# Altium schematic sheet [5] AnalogChannels_1_2_3_4.SchDoc: =DocumentName
size A3; Organization: ORGANIZATION; Address1: R. Aprígio Veloso, 882, Universitário; Address2: Campina Grande - PB; Address3: 58429-900; DocumentNumber: 5; Revision: -; SheetNumber: 5; SheetTotal: 8; ENG_DATE: --/--/--; DSN_DATE: --/--/--; CHK_DATE: --/--/--; SCH_SCALE: 1:1
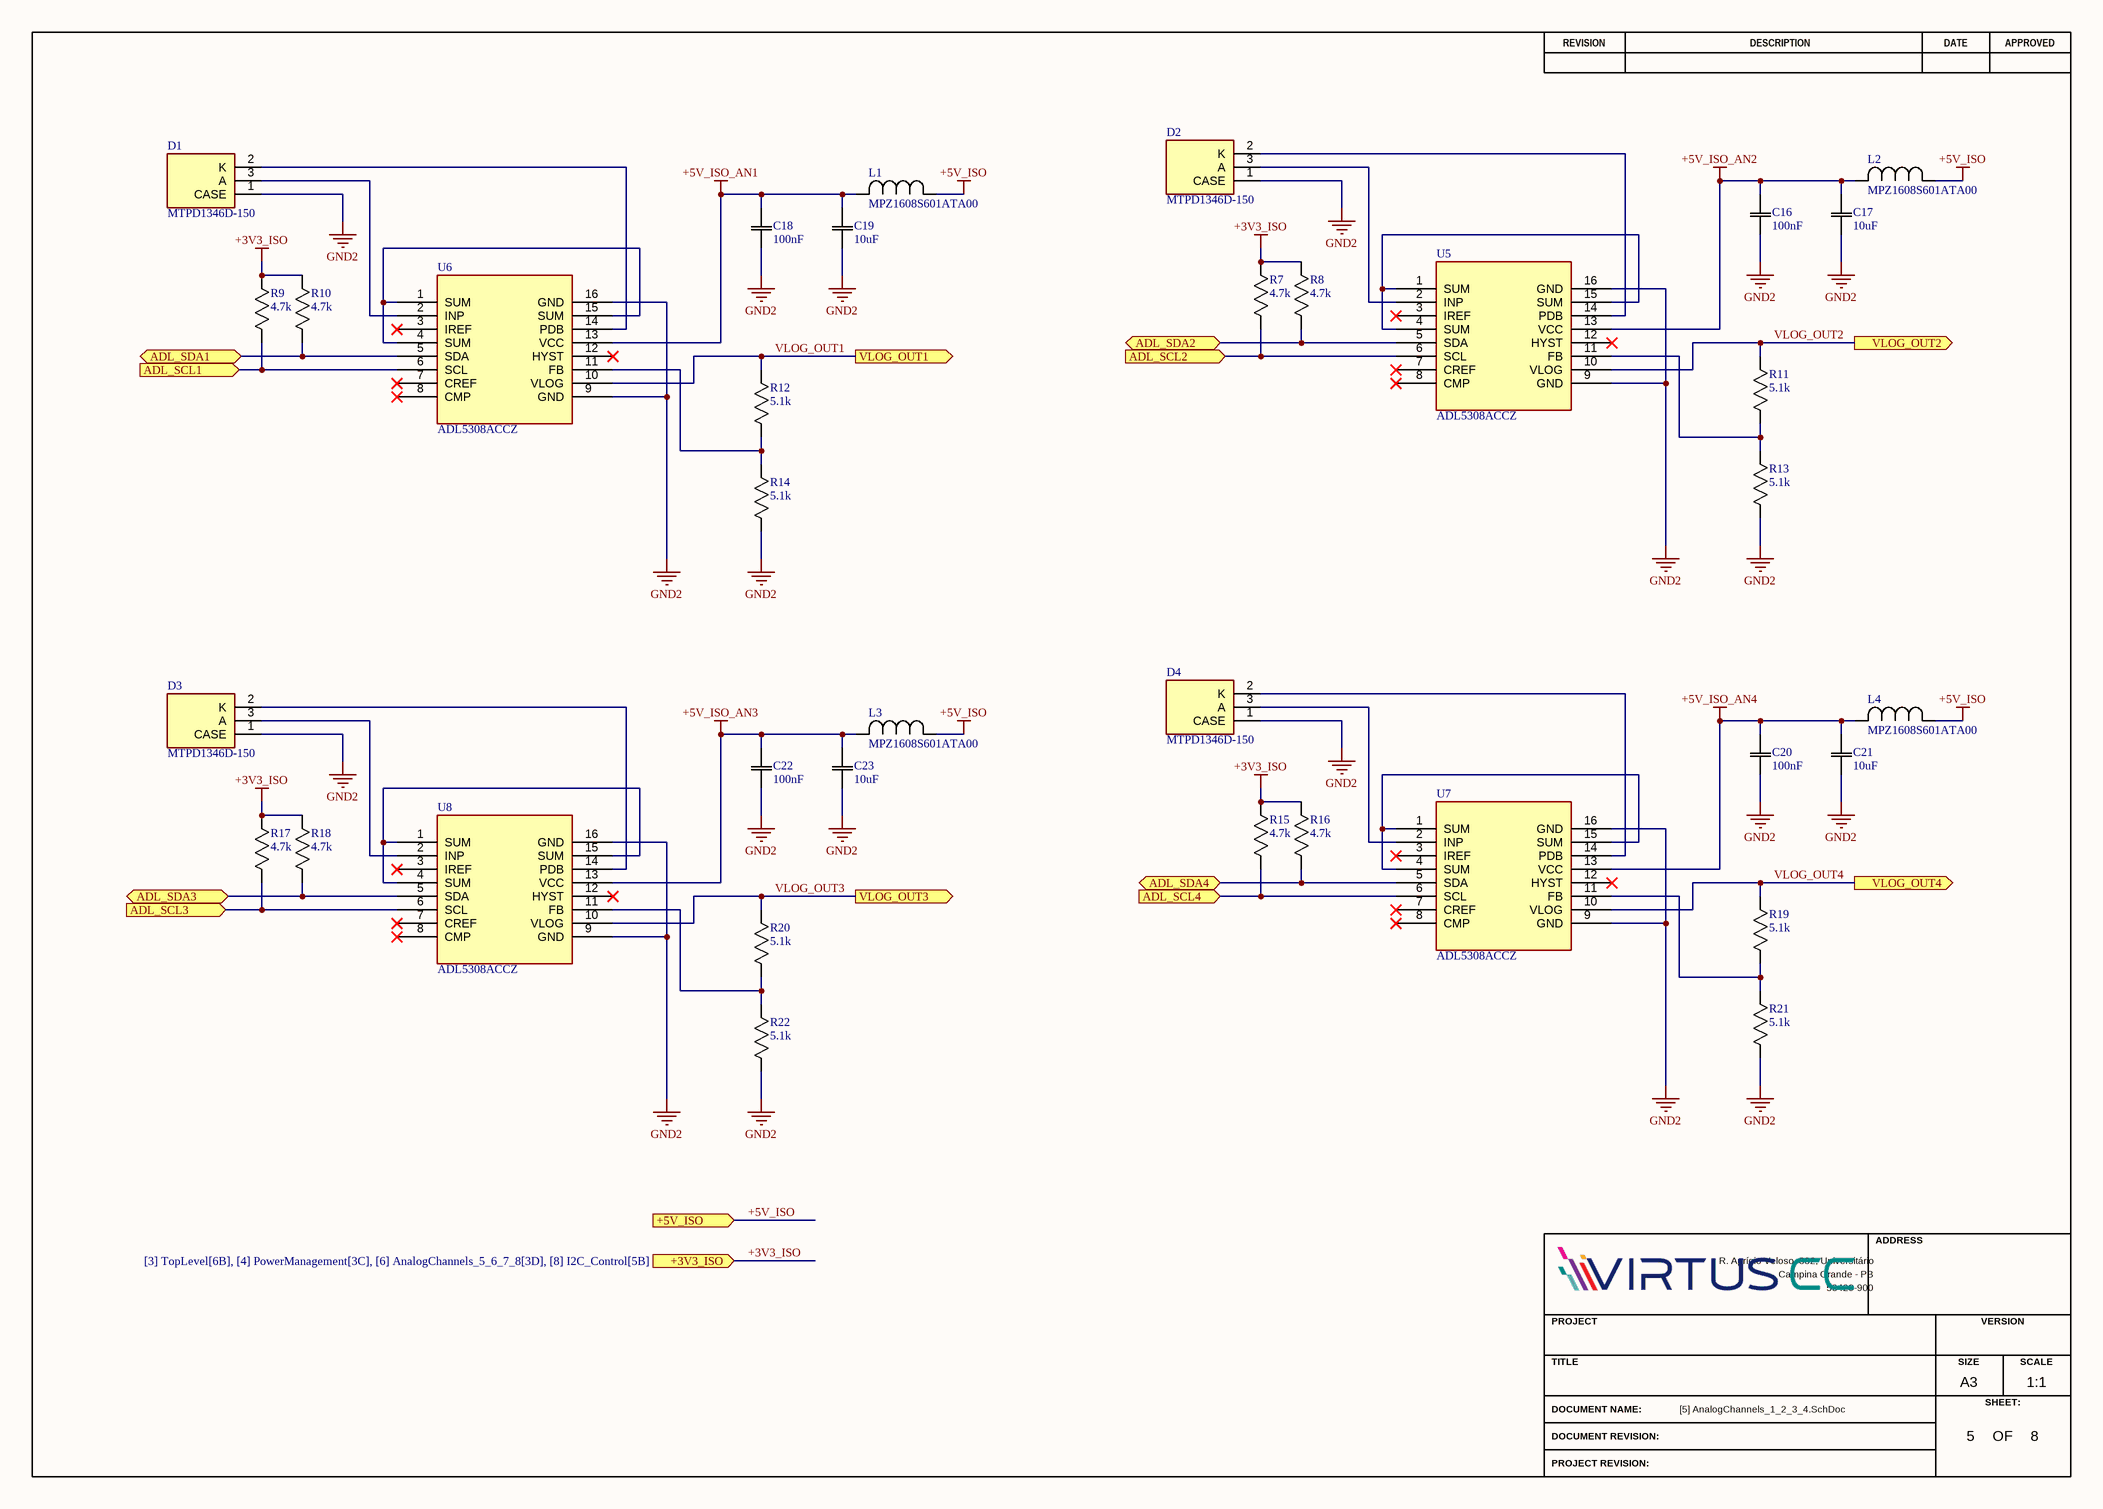
[diagram p0: [5] AnalogChannels_1_2_3_4.SchDoc]

## Parts
C16  value 100nF  [CAPC1005X40N]  (hidden comment: GCM155R71H104KE02D)
C17  value 10uF  [CAPC1005X40N]  (hidden comment: GRT155R61A106ME13D)
C18  value 100nF  [CAPC1005X40N]  (hidden comment: GCM155R71H104KE02D)
C19  value 10uF  [CAPC1005X40N]  (hidden comment: GRT155R61A106ME13D)
C20  value 100nF  [CAPC1005X40N]  (hidden comment: GCM155R71H104KE02D)
C21  value 10uF  [CAPC1005X40N]  (hidden comment: GRT155R61A106ME13D)
C22  value 100nF  [CAPC1005X40N]  (hidden comment: GCM155R71H104KE02D)
C23  value 10uF  [CAPC1005X40N]  (hidden comment: GRT155R61A106ME13D)
D1  MTPD1346D-150  [TO127P540X1680-3N]
D2  MTPD1346D-150  [TO127P540X1680-3N]
D3  MTPD1346D-150  [TO127P540X1680-3N]
D4  MTPD1346D-150  [TO127P540X1680-3N]
L1  MPZ1608S601ATA00  [INDC1608X06N]
L2  MPZ1608S601ATA00  [INDC1608X06N]
L3  MPZ1608S601ATA00  [INDC1608X06N]
L4  MPZ1608S601ATA00  [INDC1608X06N]
R7  value 4.7k  [RESC1005X40N]  (hidden comment: RC0402FR-074K7L)
R8  value 4.7k  [RESC1005X40N]  (hidden comment: RC0402FR-074K7L)
R9  value 4.7k  [RESC1005X40N]  (hidden comment: RC0402FR-074K7L)
R10  value 4.7k  [RESC1005X40N]  (hidden comment: RC0402FR-074K7L)
R11  value 5.1k  [RESC1005X40N]  (hidden comment: RC0402FR-075K1L)
R12  value 5.1k  [RESC1005X40N]  (hidden comment: RC0402FR-075K1L)
R13  value 5.1k  [RESC1005X40N]  (hidden comment: RC0402FR-075K1L)
R14  value 5.1k  [RESC1005X40N]  (hidden comment: RC0402FR-075K1L)
R15  value 4.7k  [RESC1005X40N]  (hidden comment: RC0402FR-074K7L)
R16  value 4.7k  [RESC1005X40N]  (hidden comment: RC0402FR-074K7L)
R17  value 4.7k  [RESC1005X40N]  (hidden comment: RC0402FR-074K7L)
R18  value 4.7k  [RESC1005X40N]  (hidden comment: RC0402FR-074K7L)
R19  value 5.1k  [RESC1005X40N]  (hidden comment: RC0402FR-075K1L)
R20  value 5.1k  [RESC1005X40N]  (hidden comment: RC0402FR-075K1L)
R21  value 5.1k  [RESC1005X40N]  (hidden comment: RC0402FR-075K1L)
R22  value 5.1k  [RESC1005X40N]  (hidden comment: RC0402FR-075K1L)
U5  ADL5308ACCZ  [CC-14-4_ADI]
U6  ADL5308ACCZ  [CC-14-4_ADI]
U7  ADL5308ACCZ  [CC-14-4_ADI]
U8  ADL5308ACCZ  [CC-14-4_ADI]

## Ports
+3V3_ISO (in, see [3] TopLevel[6B], [4] PowerManagement[3C], [6] AnalogChannels_5_6_7_8[3D], [8] I2C_Control[5B]), +5V_ISO (in, see [3] TopLevel[6B], [4] PowerManagement[4B], [6] AnalogChannels_5_6_7_8[3D]), ADL_SCL1 (in, see [3] TopLevel[6B], [8] I2C_Control[3A]), ADL_SCL2 (in, see [3] TopLevel[6B], [8] I2C_Control[3B]), ADL_SCL3 (in, see [3] TopLevel[6B], [8] I2C_Control[3B]), ADL_SCL4 (in, see [3] TopLevel[6B], [8] I2C_Control[3B]), ADL_SDA1 (bidir, see [3] TopLevel[6B], [8] I2C_Control[3A]), ADL_SDA2 (bidir, see [3] TopLevel[6B], [8] I2C_Control[3B]), ADL_SDA3 (bidir, see [3] TopLevel[6B], [8] I2C_Control[3B]), ADL_SDA4 (bidir, see [3] TopLevel[6B], [8] I2C_Control[3B]), VLOG_OUT1 (out, see [3] TopLevel[7B], [7] ADC_Acquisition[3A]), VLOG_OUT2 (out, see [3] TopLevel[7B], [7] ADC_Acquisition[3A]), VLOG_OUT3 (out, see [3] TopLevel[7B], [7] ADC_Acquisition[3A]), VLOG_OUT4 (out, see [3] TopLevel[7B], [7] ADC_Acquisition[3A])

## Nets
+3V3_ISO: R7.1 R8.1 R9.1 R10.1 R15.1 R16.1 R17.1 R18.1 ; port +3V3_ISO
+5V_ISO: L1.1 L2.1 L3.1 L4.1 ; port +5V_ISO
+5V_ISO_AN1: C18.2 C19.2 L1.2 U6.13(VCC)
+5V_ISO_AN2: C16.2 C17.2 L2.2 U5.13(VCC)
+5V_ISO_AN3: C22.2 C23.2 L3.2 U8.13(VCC)
+5V_ISO_AN4: C20.2 C21.2 L4.2 U7.13(VCC)
GND2: C16.1 C17.1 C18.1 C19.1 C20.1 C21.1 C22.1 C23.1 D1.1(CASE) D2.1(CASE) D3.1(CASE) D4.1(CASE) R13.2 R14.2 R21.2 R22.2 U5.9(GND) U5.16(GND) U6.9(GND) U6.16(GND) U7.9(GND) U7.16(GND) U8.9(GND) U8.16(GND)
ADL_SCL1: R9.2 U6.6(SCL) ; port ADL_SCL1
ADL_SCL2: R7.2 U5.6(SCL) ; port ADL_SCL2
ADL_SCL3: R17.2 U8.6(SCL) ; port ADL_SCL3
ADL_SCL4: R15.2 U7.6(SCL) ; port ADL_SCL4
ADL_SDA1: R10.2 U6.5(SDA) ; port ADL_SDA1
ADL_SDA2: R8.2 U5.5(SDA) ; port ADL_SDA2
ADL_SDA3: R18.2 U8.5(SDA) ; port ADL_SDA3
ADL_SDA4: R16.2 U7.5(SDA) ; port ADL_SDA4
VLOG_OUT1: R12.1 U6.10(VLOG) ; port VLOG_OUT1
VLOG_OUT2: R11.1 U5.10(VLOG) ; port VLOG_OUT2
VLOG_OUT3: R20.1 U8.10(VLOG) ; port VLOG_OUT3
VLOG_OUT4: R19.1 U7.10(VLOG) ; port VLOG_OUT4
NetD1_2: D1.2(K) U6.14(PDB)
NetD1_3: D1.3(A) U6.2(INP)
NetD2_2: D2.2(K) U5.14(PDB)
NetD2_3: D2.3(A) U5.2(INP)
NetD3_2: D3.2(K) U8.14(PDB)
NetD3_3: D3.3(A) U8.2(INP)
NetD4_2: D4.2(K) U7.14(PDB)
NetD4_3: D4.3(A) U7.2(INP)
NetR11_2: R11.2 R13.1 U5.11(FB)
NetR12_2: R12.2 R14.1 U6.11(FB)
NetR19_2: R19.2 R21.1 U7.11(FB)
NetR20_2: R20.2 R22.1 U8.11(FB)
NetU5_1: U5.1(SUM) U5.4(SUM) U5.15(SUM)
NetU6_1: U6.1(SUM) U6.4(SUM) U6.15(SUM)
NetU7_1: U7.1(SUM) U7.4(SUM) U7.15(SUM)
NetU8_1: U8.1(SUM) U8.4(SUM) U8.15(SUM)

Not connected (* = marked no-connect by the designer): U5 3(IREF)* 7(CREF)* 8(CMP)* 12(HYST)*; U6 3(IREF)* 7(CREF)* 8(CMP)* 12(HYST)*; U7 3(IREF)* 7(CREF)* 8(CMP)* 12(HYST)*; U8 3(IREF)* 7(CREF)* 8(CMP)* 12(HYST)*

## Notes on the sheet
- REVISION
- DESCRIPTION
- DATE
- APPROVED
- ADDRESS
- PROJECT
- VERSION
- TITLE
- A3
- SIZE
- SCALE
- DOCUMENT NAME:
- DOCUMENT REVISION:
- OF
- SHEET:
- PROJECT REVISION:

## Library data of the parts
C16 C18 C20 C22 = GCM155R71H104KE02D: 0.1 µF ±10% 50V Ceramic Capacitor X7R 0402 (1005 Metric); Manufacturer_Name: Murata; Copyright: Copyright (C) 2026 Ultra Librarian. All rights reserved.; Manufacturer_Part_Number: GCM155R71H104KE02D; Supplier 1: DigiKey; Supplier Part Number 1: 490-10672-1-ND; Datasheet Link: https://search.murata.co.jp/Ceramy/image/img/A01X/G101/ENG/GCM155R71H104KE02-01.pdf
C17 C19 C21 C23 = GRT155R61A106ME13D: 10 µF ±20% 10V Ceramic Capacitor X5R 0402 (1005 Metric); Manufacturer_Name: Murata; Copyright: Copyright (C) 2026 Ultra Librarian. All rights reserved.; Manufacturer_Part_Number: GRT155R61A106ME13D; Supplier 1: DigiKey; Supplier Part Number 1: 490-GRT155R61A106ME13DCT-ND; Datasheet Link: https://search.murata.co.jp/Ceramy/image/img/A01X/G101/ENG/GRT155R61A106ME13-01A.pdf
D1-D4 = MTPD1346D-150: Photodiode 1300nm TO-46-3 Lens Top Metal Can; Manufacturer_Name: Marktech Optoelectronics; SnapEDA_Link: https://www.snapeda.com/parts/MTPD1346D-150/Marktech%20Optoelectronics/view-part/2762424/?ref=snap; Value: MTPD1346D-150; Package: TO-46-3 Marktech Optoelectronics; Supplier 1: Digikey; Supplier Part Number 1: 1125-1327-ND; Manufacturer_Part_Number: MTPD1346D-150; Datasheet Link: https://specs.marktechopto.com/pdf/products/datasheet/MTPD1346D-150.pdf
L1-L4 = MPZ1608S601ATA00: INDUCTOR; SMT (0603); FERRITE-BEAD; 600; TOL=+/-25%; 1A; -55 DEGC TO +125 DEGC; Manufacturer_Name: TDK; Copyright: Copyright (C) 2026 Ultra Librarian. All rights reserved.; Manufacturer_Part_Number: MPZ1608S601ATA00; Supplier 1: DigiKey; Supplier Part Number 1: 445-MPZ1608S601ATA00CT-ND; Supplier 2: Mouser; Supplier Part Number 2: 810-MPZ1608S601ATA00; Value: MPZ1608S601ATA00; Datasheet Link: https://product.tdk.com/en/system/files/dam/doc/product/emc/emc/beads/catalog/beads_commercial_power_mpz1608_en.pdf
R7-R10 R15-R18 = RC0402FR-074K7L: 4.7 kOhms ±1% 0.063W, 1/16W Chip Resistor 0402 (1005 Metric) Moisture Resistant Thick Film; Manufacturer_Name: Yageo; Copyright: Copyright (C) 2025 Ultra Librarian. All rights reserved.; Manufacturer_Part_Number: RC0402FR-074K7L; Supplier: Digikey; Supplier 1: DigiKey; Supplier Part Number 1: 311-4.7KLRCT-ND; Datasheet Link: https://yageogroup.com/content/datasheet/asset/file/PYU-RC_GROUP_51_ROHS_L
R11-R14 R19-R22 = RC0402FR-075K1L: 5.1 kOhms ±1% 0.063W, 1/16W Chip Resistor 0402 (1005 Metric) Moisture Resistant Thick Film; Manufacturer_Name: Yageo; Copyright: Copyright (C) 2025 Ultra Librarian. All rights reserved.; Manufacturer_Part_Number: RC0402FR-075K1L; Supplier: Digikey; Supplier 1: DigiKey; Supplier Part Number 1: 311-5.10KLRDKR-ND; Datasheet Link: https://yageogroup.com/content/datasheet/asset/file/PYU-RC_GROUP_51_ROHS_L
U5-U8 = ADL5308ACCZ: Logarithmic Converter, 105Deg C, Lga-Ep Rohs Compliant: Yes |Analog Devices, Inc. ADL5308ACCZ; Supplier: DigiKey; Supplier Part Number: 505-ADL5308ACCZ-ND; Category: Integrated Circuits (ICs); ComponentLink1URL: https://octopart.com:443/opatz8j6/c1?t=RA9GQZinOd29-lgehR1mMjPVps_pwNRaRgVV1YHzAIV5tl_XZCUSSAHitgBUBAYOkyHWZwhmuKnJMJd5RxR1VqE6m3xnviegrgL6shNBcrpF4LfPbYQ25RAGHFA1T9s0JOT-tl-QhPVPfLuNoqTz_6GGuiJfIxRC0S7r0DYLo04TjJESfYEQgeF8hwJXvZVADboypZr_g-Ea1XOnqBF-rgke93XuIMELyUETblR1X_UOadx82_PQ_RlLZBBqxzR00efRp-5niCJZslCBmJMmtGL_WYk9XjRWZNLGIjLbjTB1vQWuYu6Ttro&src-supplier=Analog+Devices; ComponentLink1Description: https://octopart.com:443/opatz8j6/c1?t=RA9GQZinOd29-lgehR1mMjPVps_pwNRaRgVV1YHzAIV5tl_XZCUSSAHitgBUBAYOkyHWZwhmuKnJMJd5RxR1VqE6m3xnviegrgL6shNBcrpF4LfPbYQ25RAGHFA1T9s0JOT-tl-QhPVPfLuNoqTz_6GGuiJfIxRC0S7r0DYLo04TjJESfYEQgeF8hwJXvZVADboypZr_g-Ea1XOnqBF-rgke93XuIMELyUETblR1X_UOadx82_PQ_RlLZBBqxzR00efRp-5niCJZslCBmJMmtGL_WYk9XjRWZNLGIjLbjTB1vQWuYu6Ttro&src-supplier=Analog+Devices; ComponentLink2URL: http://sigma.octopart.com:80/conflict_mineral_statement/Analog-Devices-company-33.pdf?src-supplier=Compliance+Statements; ComponentLink2Description: http://sigma.octopart.com:80/conflict_mineral_statement/Analog-Devices-company-33.pdf?src-supplier=Compliance+Statements; ComponentLink3URL: https://octopart.com:443/opatz8j6/c1?t=vRyEE9f1knuZsXfZ1EXV0igJkx_-mJPvDe2PRj94G0bMKfSINrZLJy9UxvHag1Ev7-JZTv2yES3irMYFchBWTpWzSwFH9zvLS0b9JOrPs9Pp2SMp_5VkKg4D-b9XM9N4Wk1jNVgkSgkhW8YH7ZyvkiIcKE_oeD_Hqil2BcqMABFddqLYAoPEQj49TJ_q7pMpzWSP-EVr2GWpI1kmAhJOGILngaZVyGxqQjwZ-ZoOI0z0mJCfXwlyMjB28ReNlNurs-8EToiXecBFaJGtKdUbF4KCBm4bpE5gucx16B8aD2Bl3eu5--byB1E&src-supplier=Compliance+Statements; ComponentLink3Description: https://octopart.com:443/opatz8j6/c1?t=vRyEE9f1knuZsXfZ1EXV0igJkx_-mJPvDe2PRj94G0bMKfSINrZLJy9UxvHag1Ev7-JZTv2yES3irMYFchBWTpWzSwFH9zvLS0b9JOrPs9Pp2SMp_5VkKg4D-b9XM9N4Wk1jNVgkSgkhW8YH7ZyvkiIcKE_oeD_Hqil2BcqMABFddqLYAoPEQj49TJ_q7pMpzWSP-EVr2GWpI1kmAhJOGILngaZVyGxqQjwZ-ZoOI0z0mJCfXwlyMjB28ReNlNurs-8EToiXecBFaJGtKdUbF4KCBm4bpE5gucx16B8aD2Bl3eu5--byB1E&src-supplier=Compliance+Statements; Supplier 1: DigiKey; Supplier Part Number 1: 505-ADL5308ACCZ-ND; Manufacturer_Name: Analog Devices; Manufacturer_Part_Number: ADL5308ACCZ; Datasheet Link: https://www.analog.com/media/en/technical-documentation/data-sheets/adl5308.pdf; Value: ADL5308ACCZ